# Altium schematic sheet Y1BVER2.0_4.SchDoc
size A3
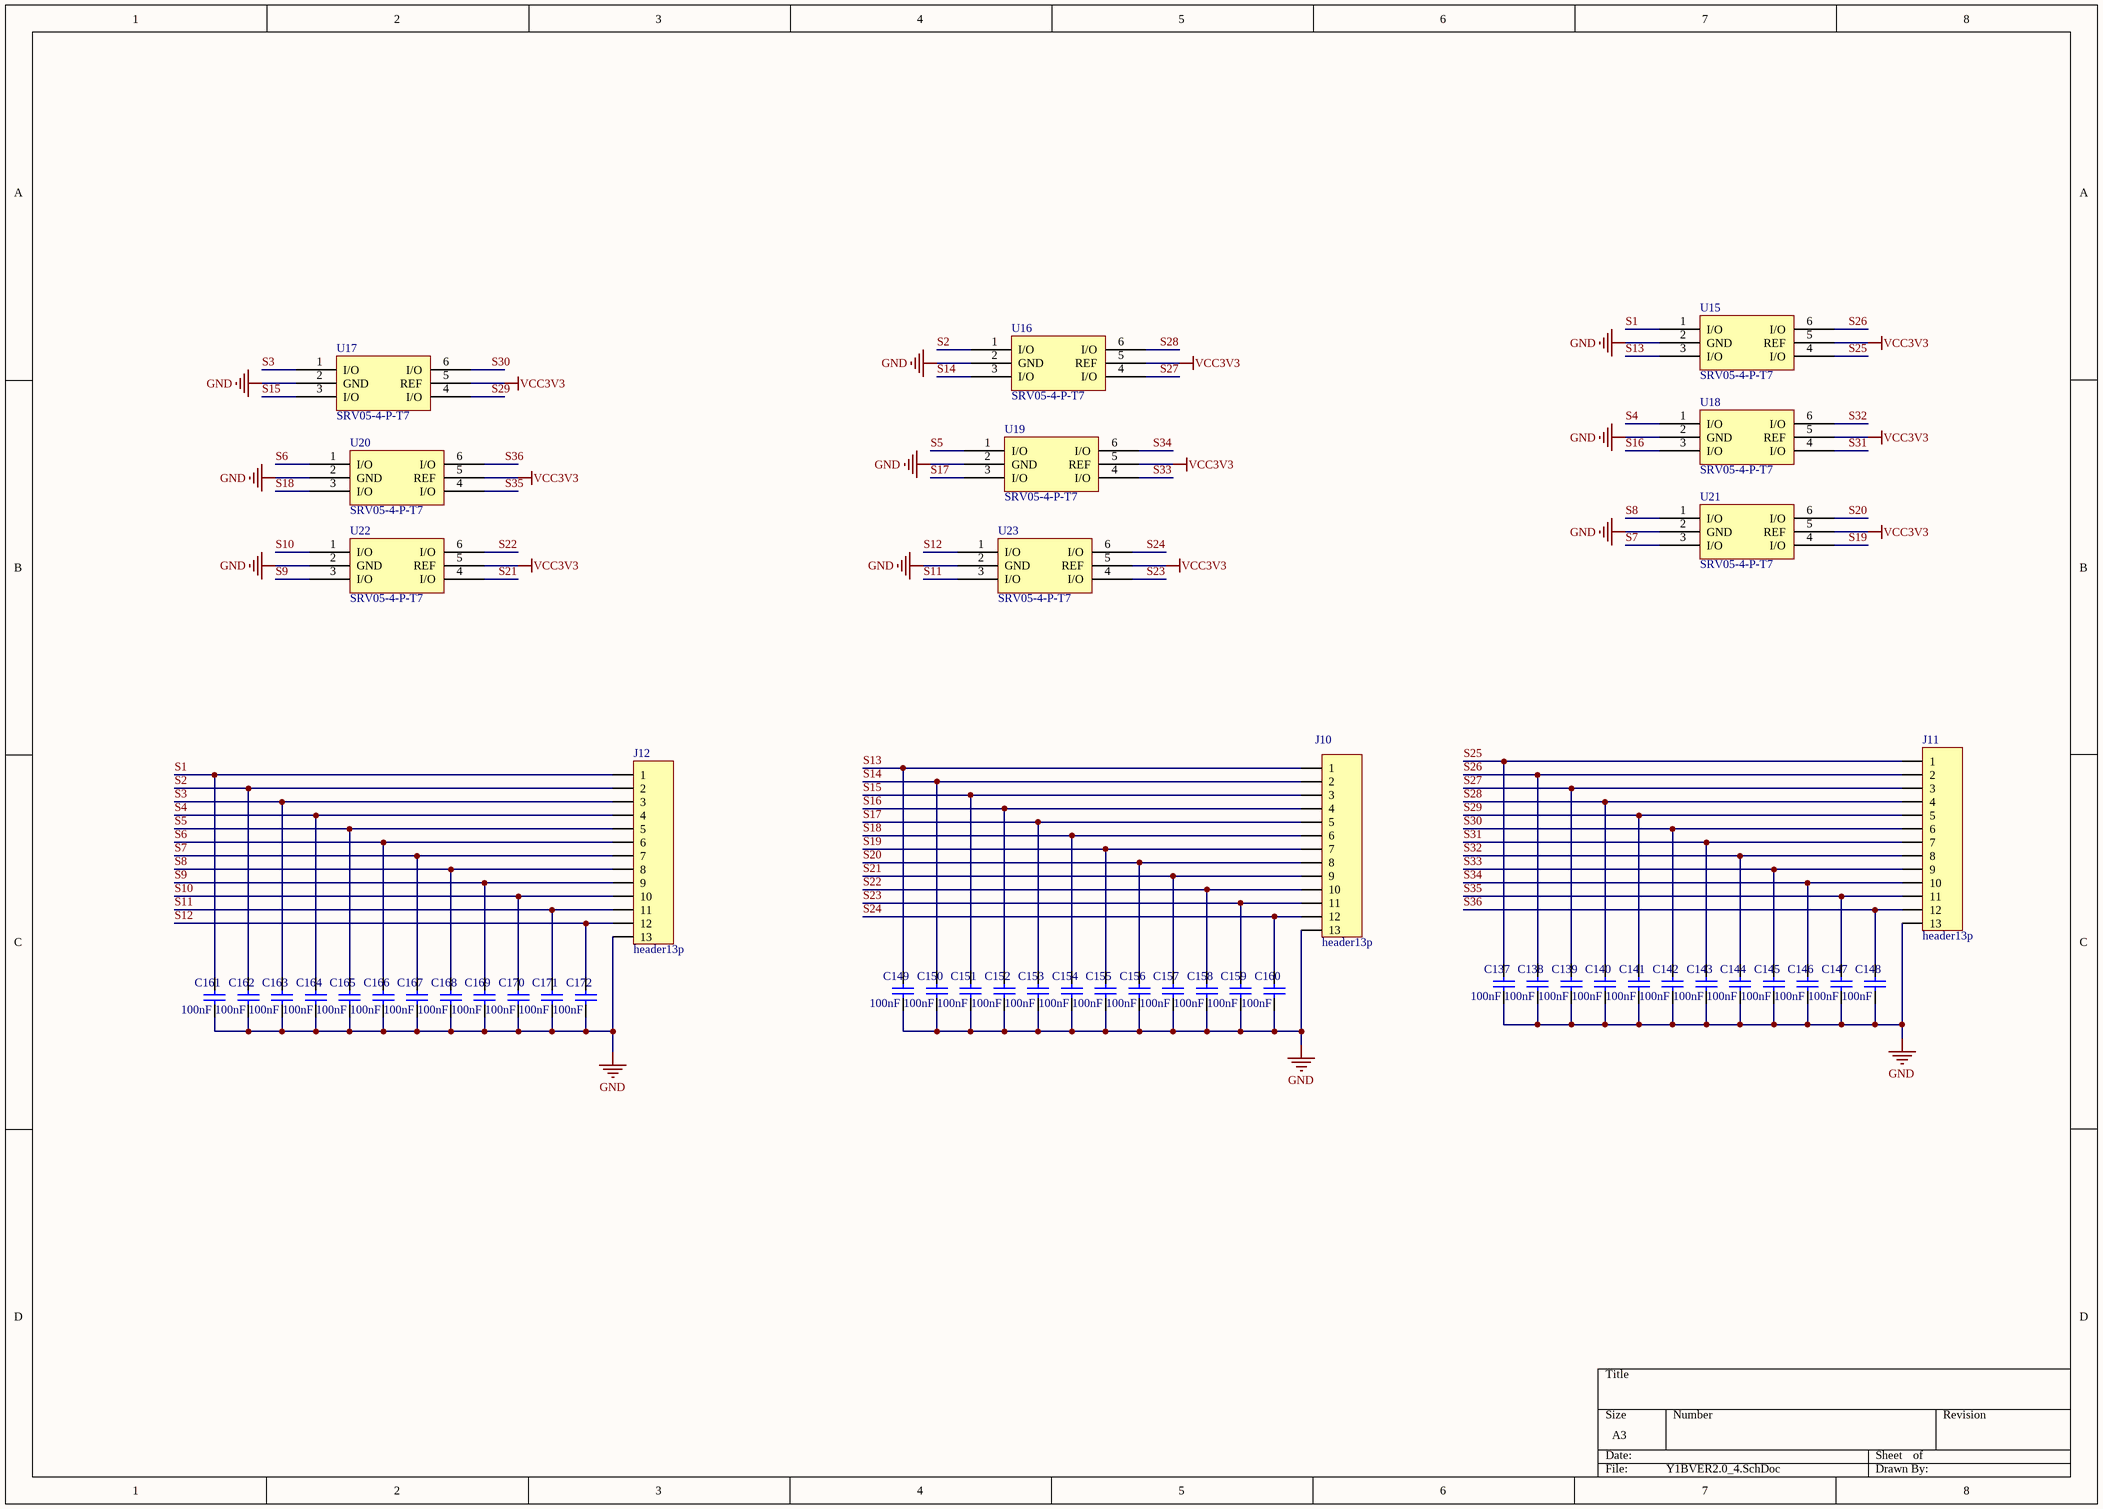
[diagram p0: Y1BVER2.0_4.SchDoc]

## Parts
C137  100nF  [0603_C]
C138  100nF  [0603_C]
C139  100nF  [0603_C]
C140  100nF  [0603_C]
C141  100nF  [0603_C]
C142  100nF  [0603_C]
C143  100nF  [0603_C]
C144  100nF  [0603_C]
C145  100nF  [0603_C]
C146  100nF  [0603_C]
C147  100nF  [0603_C]
C148  100nF  [0603_C]
C149  100nF  [0603_C]
C150  100nF  [0603_C]
C151  100nF  [0603_C]
C152  100nF  [0603_C]
C153  100nF  [0603_C]
C154  100nF  [0603_C]
C155  100nF  [0603_C]
C156  100nF  [0603_C]
C157  100nF  [0603_C]
C158  100nF  [0603_C]
C159  100nF  [0603_C]
C160  100nF  [0603_C]
C161  100nF  [0603_C]
C162  100nF  [0603_C]
C163  100nF  [0603_C]
C164  100nF  [0603_C]
C165  100nF  [0603_C]
C166  100nF  [0603_C]
C167  100nF  [0603_C]
C168  100nF  [0603_C]
C169  100nF  [0603_C]
C170  100nF  [0603_C]
C171  100nF  [0603_C]
C172  100nF  [0603_C]
J10  header13p  [xh-13]
J11  header13p  [xh-13]
J12  header13p  [xh-13]
U15  SRV05-4-P-T7  [SOT-23-6]
U16  SRV05-4-P-T7  [SOT-23-6]
U17  SRV05-4-P-T7  [SOT-23-6]
U18  SRV05-4-P-T7  [SOT-23-6]
U19  SRV05-4-P-T7  [SOT-23-6]
U20  SRV05-4-P-T7  [SOT-23-6]
U21  SRV05-4-P-T7  [SOT-23-6]
U22  SRV05-4-P-T7  [SOT-23-6]
U23  SRV05-4-P-T7  [SOT-23-6]

## Nets
GND: C137.2 C138.2 C139.2 C140.2 C141.2 C142.2 C143.2 C144.2 C145.2 C146.2 C147.2 C148.2 C149.2 C150.2 C151.2 C152.2 C153.2 C154.2 C155.2 C156.2 C157.2 C158.2 C159.2 C160.2 C161.2 C162.2 C163.2 C164.2 C165.2 C166.2 C167.2 C168.2 C169.2 C170.2 C171.2 C172.2 J10.13 J11.13 J12.13 U15.2(GND) U16.2(GND) U17.2(GND) U18.2(GND) U19.2(GND) U20.2(GND) U21.2(GND) U22.2(GND) U23.2(GND)
VCC3V3: U15.5(REF) U16.5(REF) U17.5(REF) U18.5(REF) U19.5(REF) U20.5(REF) U21.5(REF) U22.5(REF) U23.5(REF)
S1: C161.1 J12.1 U15.1(I/O)
S2: C162.1 J12.2 U16.1(I/O)
S3: C163.1 J12.3 U17.1(I/O)
S4: C164.1 J12.4 U18.1(I/O)
S5: C165.1 J12.5 U19.1(I/O)
S6: C166.1 J12.6 U20.1(I/O)
S7: C167.1 J12.7 U21.3(I/O)
S8: C168.1 J12.8 U21.1(I/O)
S9: C169.1 J12.9 U22.3(I/O)
S10: C170.1 J12.10 U22.1(I/O)
S11: C171.1 J12.11 U23.3(I/O)
S12: C172.1 J12.12 U23.1(I/O)
S13: C149.1 J10.1 U15.3(I/O)
S14: C150.1 J10.2 U16.3(I/O)
S15: C151.1 J10.3 U17.3(I/O)
S16: C152.1 J10.4 U18.3(I/O)
S17: C153.1 J10.5 U19.3(I/O)
S18: C154.1 J10.6 U20.3(I/O)
S19: C155.1 J10.7 U21.4(I/O)
S20: C156.1 J10.8 U21.6(I/O)
S21: C157.1 J10.9 U22.4(I/O)
S22: C158.1 J10.10 U22.6(I/O)
S23: C159.1 J10.11 U23.4(I/O)
S24: C160.1 J10.12 U23.6(I/O)
S25: C137.1 J11.1 U15.4(I/O)
S26: C138.1 J11.2 U15.6(I/O)
S27: C139.1 J11.3 U16.4(I/O)
S28: C140.1 J11.4 U16.6(I/O)
S29: C141.1 J11.5 U17.4(I/O)
S30: C142.1 J11.6 U17.6(I/O)
S31: C143.1 J11.7 U18.4(I/O)
S32: C144.1 J11.8 U18.6(I/O)
S33: C145.1 J11.9 U19.4(I/O)
S34: C146.1 J11.10 U19.6(I/O)
S35: C147.1 J11.11 U20.4(I/O)
S36: C148.1 J11.12 U20.6(I/O)

## Library data of the parts
C137-C172 = 0603 100nF (104) 10% 50V: 贴片电容; ComponentLink1Description: 供应商链接; ComponentLink1URL: http://www.szlcsc.com/product/details_15331.html; Package: 0603; Supplier: LC; SuppliersPartNumber: C14663
U15-U23 = SRV05-4-P-T7_[C85364]: TVS; ComponentLink1Description: 供应商链接; ComponentLink1URL: http://www.szlcsc.com/product/details_86537.html; Package: SOT-23-6; Supplier: LC; SuppliersPartNumber: C85364